# Altium schematic sheet SDRAM.SchDoc
size A4
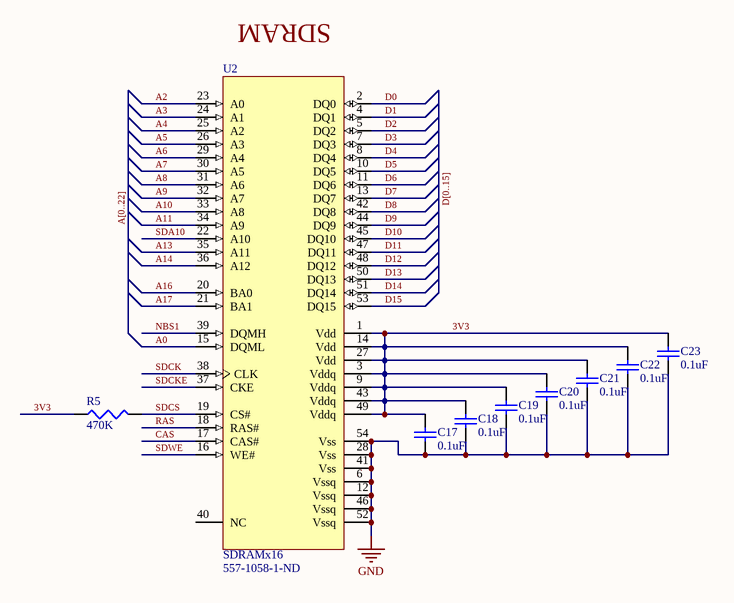
[diagram p0: SDRAM.SchDoc]

## Parts
C17  value 0.1uF  [CAPC2008X06N]  (hidden comment: Kemet_0805_a_0.1uF)
C18  value 0.1uF  [CAPC2008X06N]  (hidden comment: Kemet_0805_a_0.1uF)
C19  value 0.1uF  [CAPC2008X06N]  (hidden comment: Kemet_0805_a_0.1uF)
C20  value 0.1uF  [CAPC2008X06N]  (hidden comment: Kemet_0805_a_0.1uF)
C21  value 0.1uF  [CAPC2008X06N]  (hidden comment: Kemet_0805_a_0.1uF)
C22  value 0.1uF  [CAPC2008X06N]  (hidden comment: Kemet_0805_a_0.1uF)
C23  value 0.1uF  [CAPC2008X06N]  (hidden comment: Kemet_0805_a_0.1uF)
R5  value 470K  [RES0805]  (hidden comment: Susumu_0805_b3_470K)
U2  SDRAMx16  Supplier Part Number 1: 557-1058-1-ND  [TSOP54]

## Nets
GND: C17.1 C18.1 C19.1 C20.1 C21.1 C22.1 C23.1 U2.6(Vssq) U2.12(Vssq) U2.28(Vss) U2.41(Vss) U2.46(Vssq) U2.52(Vssq) U2.54(Vss)
3V3: C17.2 C18.2 C19.2 C20.2 C21.2 C22.2 C23.2 R5.1 U2.1(Vdd) U2.3(Vddq) U2.9(Vddq) U2.14(Vdd) U2.27(Vdd) U2.43(Vddq) U2.49(Vddq)
A0: U2.15(DQML)
A2: U2.23(A0)
A3: U2.24(A1)
A4: U2.25(A2)
A5: U2.26(A3)
A6: U2.29(A4)
A7: U2.30(A5)
A8: U2.31(A6)
A9: U2.32(A7)
A10: U2.33(A8)
A11: U2.34(A9)
A13: U2.35(A11)
A14: U2.36(A12)
A16: U2.20(BA0)
A17: U2.21(BA1)
CAS: U2.17(CAS#)
D0: U2.2(DQ0)
D1: U2.4(DQ1)
D2: U2.5(DQ2)
D3: U2.7(DQ3)
D4: U2.8(DQ4)
D5: U2.10(DQ5)
D6: U2.11(DQ6)
D7: U2.13(DQ7)
D8: U2.42(DQ8)
D9: U2.44(DQ9)
D10: U2.45(DQ10)
D11: U2.47(DQ11)
D12: U2.48(DQ12)
D13: U2.50(DQ13)
D14: U2.51(DQ14)
D15: U2.53(DQ15)
NBS1: U2.39(DQMH)
RAS: U2.18(RAS#)
SDA10: U2.22(A10)
SDCK: U2.38(CLK)
SDCKE: U2.37(CKE)
SDCS: R5.2 U2.19(CS#)
SDWE: U2.16(WE#)

Not connected (* = marked no-connect by the designer): U2 40(NC)

## Buses and harness runs
bus A[0..22]
bus D[0..15]

## Notes on the sheet
- SDRAM

## Library data of the parts
C17-C23 = Kemet_0805_a_0.1uF: CAP CER 0.1UF 50V 10% X7R 0805; Supplier 1: Digi-Key; Supplier Part Number 1: 399-1170-1-ND
R5 = Susumu_0805_b3_470K: RES 470K OHM 1/10W .5% 0805 SMD; Supplier 1: Digi-Key; Supplier Part Number 1: RR12P470KDCT-ND
U2 = SDRAMx16: SDRAM 54 TSOP II x16 architecture; Manufacturer: Micron Technology INC.; Supplier 1: Digi-Key